# Altium schematic sheet Debug LEDs.SchDoc
size A
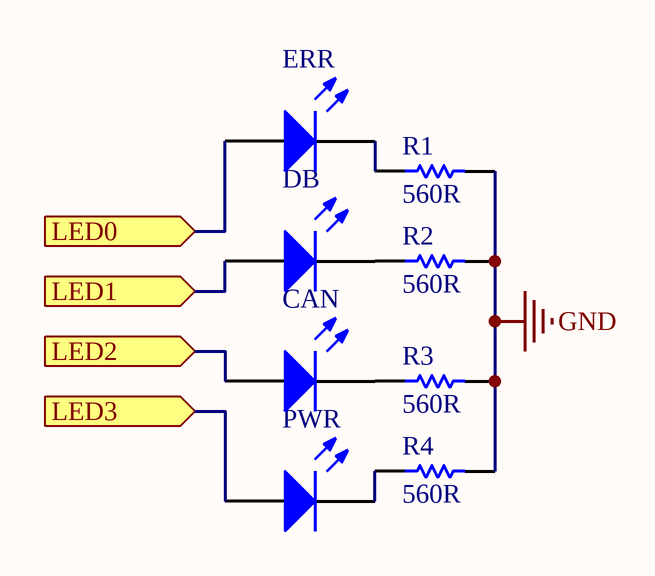
[diagram p0: Debug LEDs.SchDoc]

## Parts
CAN  150080BS75000  [0805_A]  (value not drawn)
DB  150080GS75000  [0805_A]  (value not drawn)
ERR  150080RS75000  [0805_A]  (value not drawn)
PWR  150080YS75000  [0805_A]  (value not drawn)
R1  560R  [RESC0805(2012)_M]
R2  560R  [RESC0805(2012)_M]
R3  560R  [RESC0805(2012)_M]
R4  560R  [RESC0805(2012)_M]

## Ports
LED0 (in), LED1 (in), LED2 (in), LED3 (in)

## Nets
GND: R1.2 R2.2 R3.2 R4.2
LED0: ERR.2(A) ; port LED0
LED1: DB.2(A) ; port LED1
LED2: CAN.2(A) ; port LED2
LED3: PWR.2(A) ; port LED3
NetCAN_1: CAN.1(K) R3.1
NetDB_1: DB.1(K) R2.1
NetERR_1: ERR.1(K) R1.1
NetPWR_1: PWR.1(K) R4.1

## Library data of the parts
CAN = CMP-1426-00008-1: SMD mono-color Chip LED, WL-SMCW, Blue; Manufacturer: Wuerth Elektronik; Color: Blue; ComponentLink2URL: http://katalog.we-online.com/led/datasheet/150080BS75000.pdf; ComponentLink1URL: http://www.we-online.com; ComponentLink2Description: Datasheet; PackageReference: 0805_A; ComponentLink1Description: Manufacturer URL; PartNumber: 150080BS75000
DB = CMP-1426-00007-1: SMD mono-color Chip LED, WL-SMCW, Green; Manufacturer: Wuerth Elektronik; PackageReference: 0805_A; Color: Green; PartNumber: 150080GS75000; ComponentLink2URL: http://katalog.we-online.com/led/datasheet/150080GS75000.pdf; ComponentLink1URL: http://www.we-online.com; ComponentLink1Description: Manufacturer URL; ComponentLink2Description: Datasheet
ERR = CMP-1426-00011-1: SMD mono-color Chip LED, WL-SMCW, Red; Manufacturer: Wuerth Elektronik; Color: Red; PartNumber: 150080RS75000; PackageReference: 0805_A; ComponentLink2Description: Datasheet; ComponentLink1URL: http://www.we-online.com; ComponentLink1Description: Manufacturer URL; ComponentLink2URL: http://katalog.we-online.com/led/datasheet/150080RS75000.pdf
PWR = CMP-1426-00012-1: SMD mono-color Chip LED, WL-SMCW, Yellow; Manufacturer: Wuerth Elektronik; Color: Yellow; ComponentLink1URL: http://www.we-online.com; PackageReference: 0805_A; ComponentLink2URL: http://katalog.we-online.com/led/datasheet/150080YS75000.pdf; ComponentLink1Description: Manufacturer URL; ComponentLink2Description: Datasheet; PartNumber: 150080YS75000
R1-R4 = CMP-1013-00482-1: 560R 0.125W 1% 0805 (2012 Metric)  SMD; Value: 560.00 Ohm; Case-Metric: 2012; Case-EIA: 0805; Technology: SMT; Tolerance: 1 %; Power: 0.125 W